# Altium schematic sheet CW340_USERIO_debug.SchDoc: User Debug Headers
size Letter; Organization: NewAE Technology Inc.; Address1: 1083 Queen St., Suite 196; Address2: Halifax; Address3: NS; Address4: Canada B3H 0B2; DocumentNumber: .; Revision: .; SheetNumber: 25; SheetTotal: 31; SheetApproved: Yes
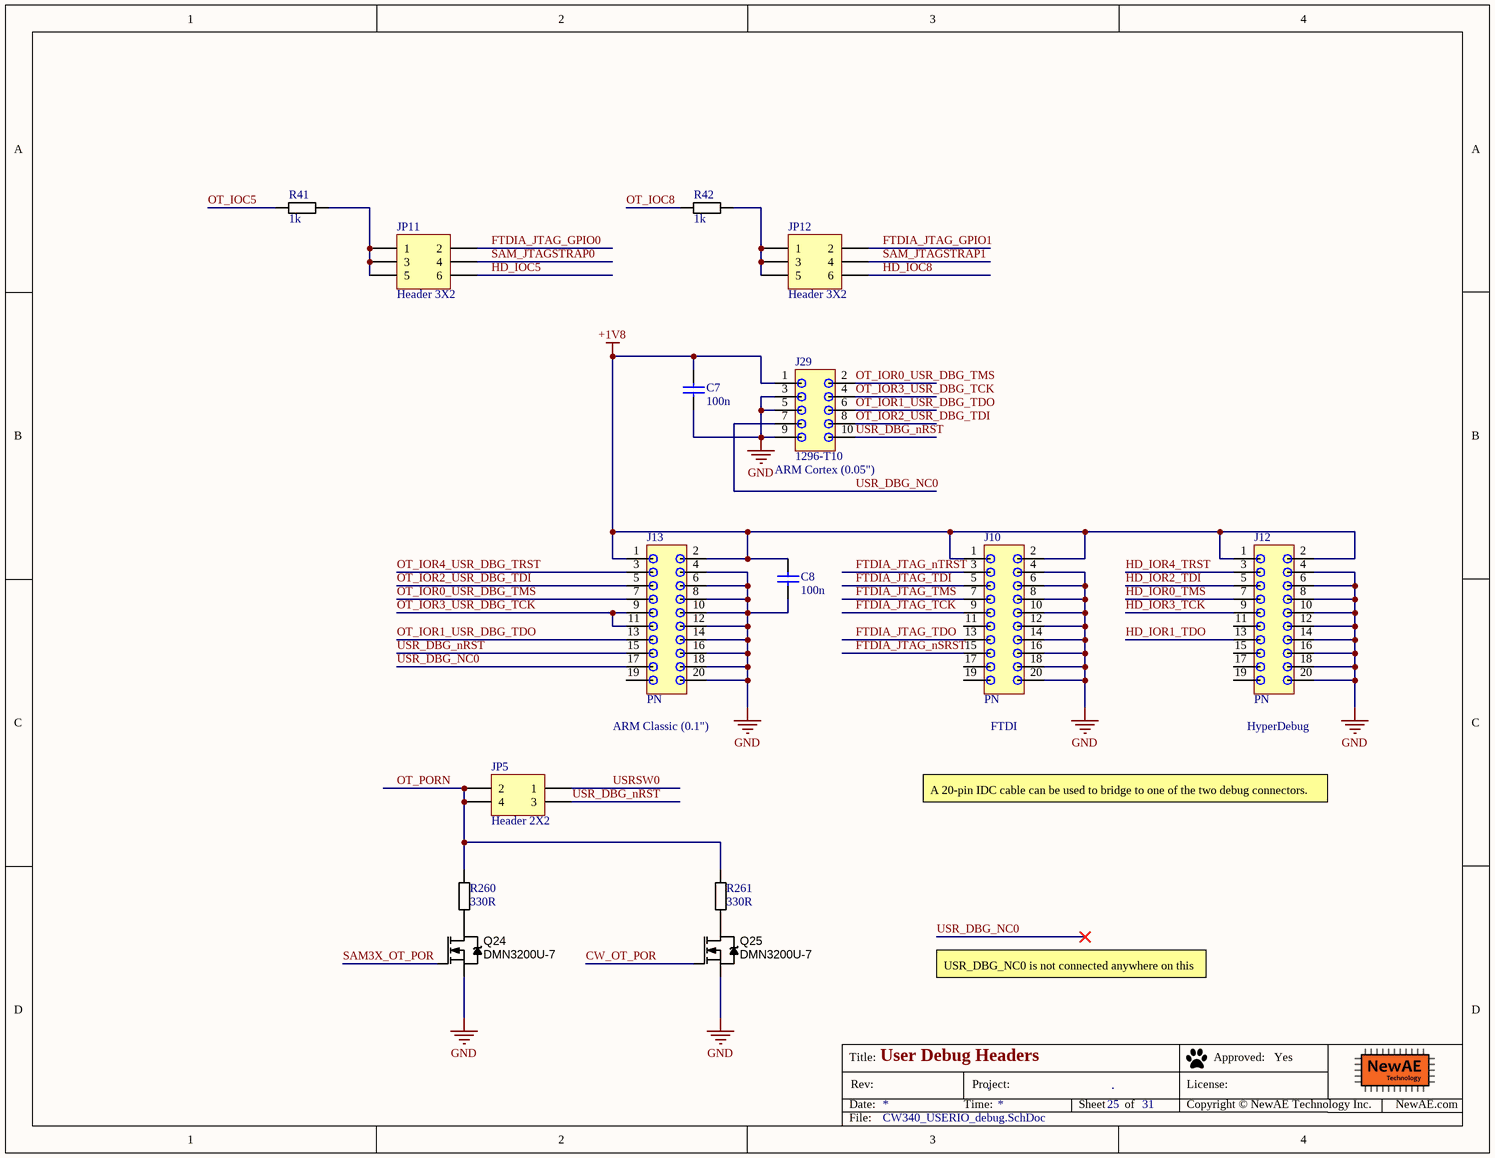
[diagram p0: CW340_USERIO_debug.SchDoc]

## Parts
C7  100n  [CAPC0603_M]
C8  100n  [CAPC0603_M]
J10  PN  [CONN_10x2_SHROUDED_2.54mm]
J12  PN  [CONN_10x2_SHROUDED_2.54mm]
J13  PN  [CONN_10x2_SHROUDED_2.54mm]
J29  1296-T10  [1296-T10]
JP5  Header 2X2  [HDR2X2]
JP11  Header 3X2  [HDR2X3]
JP12  Header 3X2  [HDR2X3]
Q24  DMN3200U-7  [SOT95P245X110-3M]
Q25  DMN3200U-7  [SOT95P245X110-3M]
R41  1k  [RESC1608X55N]
R42  1k  [RESC1608X55N]
R260  330R  [RESC1608X55N]
R261  330R  [RESC1608X55N]

## Nets
+1V8: C7.2 C8.2 J10.1 J10.2 J12.1 J12.2 J13.1 J13.2 J29.1
GND: C7.1 C8.1 J10.4 J10.6 J10.8 J10.10 J10.12 J10.14 J10.16 J10.18 J10.20 J12.4 J12.6 J12.8 J12.10 J12.12 J12.14 J12.16 J12.18 J12.20 J13.4 J13.6 J13.8 J13.10 J13.12 J13.14 J13.16 J13.18 J13.20 J29.3 J29.5 J29.9 Q24.2(S) Q25.2(S)
CW_OT_POR: Q25.1(G)
FTDIA_JTAG_GPIO0: JP11.2
FTDIA_JTAG_GPIO1: JP12.2
FTDIA_JTAG_nSRST: J10.15
FTDIA_JTAG_nTRST: J10.3
FTDIA_JTAG_TCK: J10.9
FTDIA_JTAG_TDI: J10.5
FTDIA_JTAG_TDO: J10.13
FTDIA_JTAG_TMS: J10.7
HD_IOC5: JP11.6
HD_IOC8: JP12.6
HD_IOR0_TMS: J12.7
HD_IOR1_TDO: J12.13
HD_IOR2_TDI: J12.5
HD_IOR3_TCK: J12.9
HD_IOR4_TRST: J12.3
OT_IOC5: R41.1
OT_IOC8: R42.1
OT_IOR0_USR_DBG_TMS: J13.7 J29.2
OT_IOR1_USR_DBG_TDO: J13.13 J29.6
OT_IOR2_USR_DBG_TDI: J13.5 J29.8
OT_IOR3_USR_DBG_TCK: J13.9 J13.11 J29.4
OT_IOR4_USR_DBG_TRST: J13.3
OT_PORN: JP5.2 JP5.4 R260.2 R261.2
SAM3X_OT_POR: Q24.1(G)
SAM_JTAGSTRAP0: JP11.4
SAM_JTAGSTRAP1: JP12.4
USR_DBG_NC0: J13.17 J29.7
USR_DBG_nRST: J13.15 J29.10 JP5.3
USRSW0: JP5.1
NetJP11_1: JP11.1 JP11.3 JP11.5 R41.2
NetJP12_1: JP12.1 JP12.3 JP12.5 R42.2
NetQ24_3: Q24.3(D) R260.1
NetQ25_3: Q25.3(D) R261.1

Not connected (* = marked no-connect by the designer): J10 11(9) 17(9) 19(9); J12 11(9) 15(9) 17(9) 19(9); J13 19(9)

## Notes on the sheet
- (near J29) ARM Cortex (0.05")
- (near J13) ARM Classic (0.1")
- (near J10) FTDI
- (near J12) HyperDebug
- A 20-pin IDC cable can be used to bridge to one of the two debug connectors.
- USR_DBG_NC0 is not connected anywhere on this rev/board.
- Title:
- Date:
- Rev:
- Time:
- Project:
- Sheet
- of
- License:
- Copyright © NewAE Technology Inc.
- Approved:
- NewAE.com
- File:

## Library data of the parts
C7 C8 = CCHIP-100n-0603: 100n, 0603; Manufacture 1: Kemet; Manufacture Part Number 1: C0603C104K5RACTU; Component Group: Capacitor; Case-EIA: 0603; Case-Metric: 1608; Rated Voltage: 50VDC; Part Number: CCHIP-100n-0603; Footprint: 0603; Pin Count: 2; Supplier 1: Digi-Key; Supplier Part Number 1: 399-5089-2-ND; Value: 100n; Mounting Technology: SMT; Component Kind: Standard; Component Type: Standard
J10 J12 J13 = CONN20_2ROW: Header, 2-Row, 20-pin, 0.1"; Component Group: Connector; Part Number: CONN20_2ROW; Pin Count: 20; Mounting Technology: SMT; Component Kind: Standard; Component Type: Standard
J29 = 1296-T10: Header, 10-pin, SMD, 0.05"; Manufacture Part Number 1: 20021121-00010C4LF; Component Group: Connector; Part Number: 1296-T10; Pin Count: 10; Supplier 1: Digi-Key; Supplier Part Number 1: 609-3695-1-ND; Mounting Technology: SMT; Component Kind: Standard; Component Type: Standard
JP5 = Header 2X2: Header, 2-Pin, Dual row; LatestRevisionDate: 17-Jul-2002; LatestRevisionNote: Re-released for DXP Platform.; Publisher: Altium Limited
JP11 JP12 = Header 3X2: Header, 3-Pin, Dual row; LatestRevisionDate: 17-Jul-2002; LatestRevisionNote: Re-released for DXP Platform.; Publisher: Altium Limited
Q24 Q25 = DMN3200U-7: MOSFET N-CH 30V 2.2A SOT23-3; Manufacture 1: Diodes Inc.; Rated Power: 3A; PP Material Stack: 0; Part Number: DMN3200U-7; Component Group: MOSFET; Footprint: SOT23; Manufacture Part Number 1: DMN3200U-7; Pin Count: 3; Supplier 1: Digi-Key; Supplier Part Number 1: DMN3200U-7DICT-ND; Rated Voltage: 30V; Mounting Technology: SMT; RoHS: Yes; Component Kind: Standard; Component Type: Standard; PP Rotation: 0
R41 R42 = RCHIP-1K-0603: 1k res, 0603, 1%, 1/10W; Manufacture 1: Yageo; Manufacture Part Number 1: RC0603FR-071KL; Component Group: Resistor; Case-EIA: 0603; Case-Metric: 1608; Rated Power: 0.1W; Rated Voltage: 75VDC; Part Number: RCHIP-1K-0603; Footprint: 0603; Pin Count: 2; Supplier 1: Digi-Key; Supplier Part Number 1: 311-1.00KHRCT-ND; Value: 1k; Tolerance: 1%; Mounting Technology: SMT; Temperature Range: -55C to 155C; Component Kind: Standard; Component Type: Standard
R260 R261 = RCHIP-330R-0603: 330R res, 0603, 1%, 1/10W; Manufacture 1: Yageo; Manufacture Part Number 1: RC0603FR-07330RL; Component Group: Resistor; Case-EIA: 0603; Case-Metric: 1608; Rated Power: 0.1W; Rated Voltage: 75VDC; Part Number: RCHIP-330R-0603; Footprint: 0603; Pin Count: 2; Supplier 1: Digi-Key; Supplier Part Number 1: 311-330HRCT-ND; Value: 330R; Tolerance: 1%; Mounting Technology: SMT; Temperature Range: -55C to 155C; Component Kind: Standard; Component Type: Standard